# EAGLE design Hank2 (EAGLE 7.7.0)
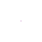
[diagram p0: schematic, sheet 1, part 1 of 2]
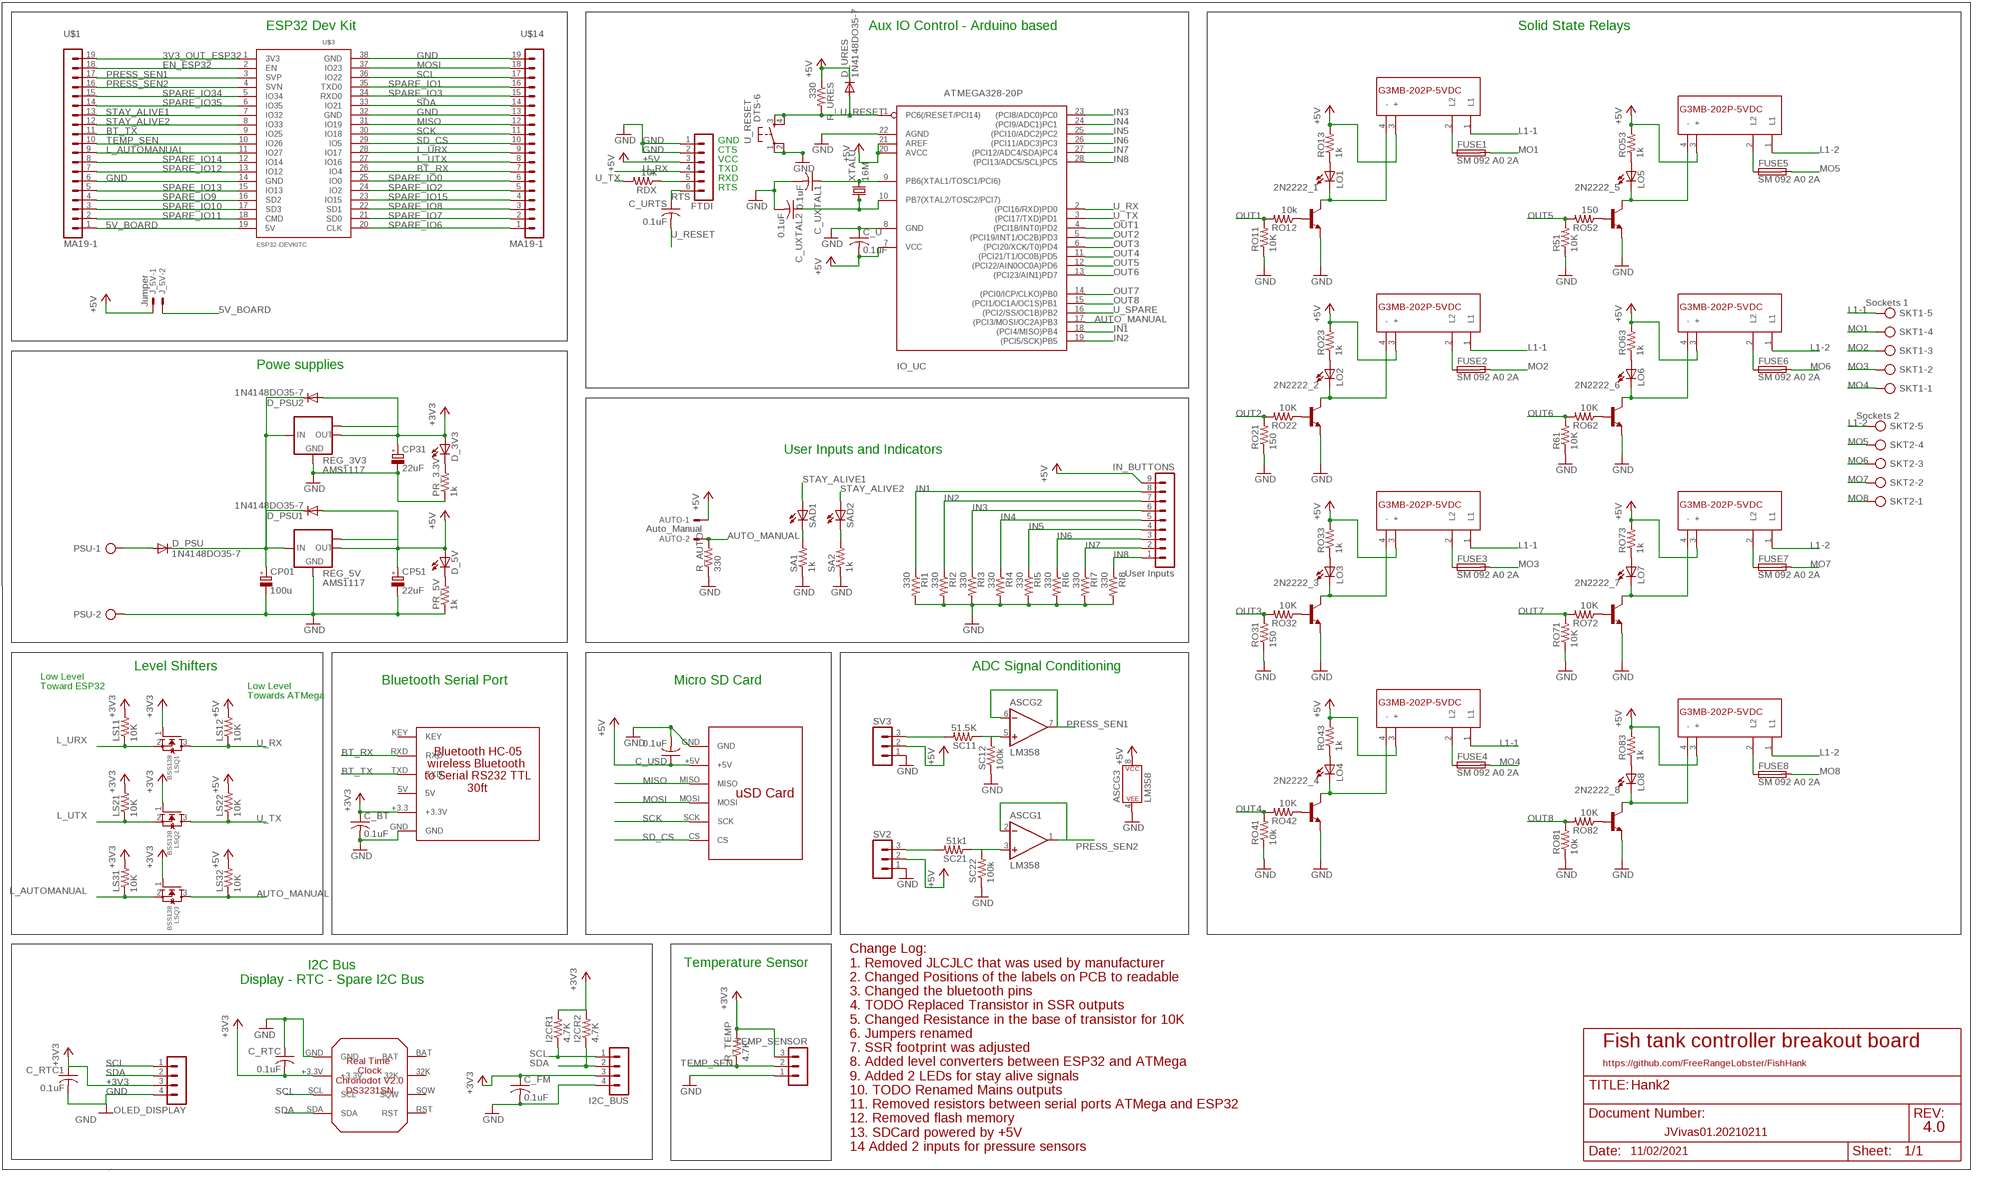
[diagram p1: schematic, sheet 1, part 2 of 2]

## Parts
2N2222_1  -NPN-TO92-EBC  [TO92-EBC]
2N2222_2  -NPN-TO92-EBC  [TO92-EBC]
2N2222_3  -NPN-TO92-EBC  [TO92-EBC]
2N2222_4  -NPN-TO92-EBC  [TO92-EBC]
2N2222_5  -NPN-TO92-EBC  [TO92-EBC]
2N2222_6  -NPN-TO92-EBC  [TO92-EBC]
2N2222_7  -NPN-TO92-EBC  [TO92-EBC]
2N2222_8  -NPN-TO92-EBC  [TO92-EBC]
ASC  LM358  [DIP08]
AUTO  Auto_Manual  22-23-2021  [22-23-2021]
C_BT  0.1uF  C-US025-024X044  [C025-024X044]
C_FM  0.1uF  C-US025-024X044  [C025-024X044]
C_RTC  0.1uF  C-US025-024X044  [C025-024X044]
C_RTC1  0.1uF  C-US025-024X044  [C025-024X044]
C_U  0.1uF  C-US025-024X044  [C025-024X044]
C_URTS  0.1uF  C-US025-024X044  [C025-024X044]
C_USD  0.1uF  C-US025-024X044  [C025-024X044]
C_UXTAL1  0.1uF  C-US025-024X044  [C025-024X044]
C_UXTAL2  0.1uF  C-US025-024X044  [C025-024X044]
CP01  100u  CPOL-EUE2.5-6  [E2,5-6]
CP31  22uF  CPOL-EUE2.5-6  [E2,5-6]
CP51  22uF  CPOL-EUE2.5-6  [E2,5-6]
D_3V3  LED3MM  [LED3MM]
D_5V  LED3MM  [LED3MM]
D_PSU  1N4148DO35-7  [DO35-7]
D_PSU1  1N4148DO35-7  [DO35-7]
D_PSU2  1N4148DO35-7  [DO35-7]
D_URES  1N4148DO35-7  [DO35-7]
FTDI  MA06-1  [MA06-1]
FUSE1  SM 092 A0 2A  FUSEPICOFUSE  [PICOFUSE]
FUSE2  SM 092 A0 2A  FUSEPICOFUSE  [PICOFUSE]
FUSE3  SM 092 A0 2A  FUSEPICOFUSE  [PICOFUSE]
FUSE4  SM 092 A0 2A  FUSEPICOFUSE  [PICOFUSE]
FUSE5  SM 092 A0 2A  FUSEPICOFUSE  [PICOFUSE]
FUSE6  SM 092 A0 2A  FUSEPICOFUSE  [PICOFUSE]
FUSE7  SM 092 A0 2A  FUSEPICOFUSE  [PICOFUSE]
FUSE8  SM 092 A0 2A  FUSEPICOFUSE  [PICOFUSE]
I2C_BUS  MA04-1  [MA04-1]
I2CR1  4.7K  R-US_0207/10  [0207/10]
I2CR2  4.7K  R-US_0207/10  [0207/10]
IN_BUTTONS  User Inputs  MA09-1  [MA09-1]
IO_UC  ATMEGA328-20P  [DIL28-3]
J_5V  Jumper  22-23-2021  [22-23-2021]
LO1  LED3MM  [LED3MM]
LO2  LED3MM  [LED3MM]
LO3  LED3MM  [LED3MM]
LO4  LED3MM  [LED3MM]
LO5  LED3MM  [LED3MM]
LO6  LED3MM  [LED3MM]
LO7  LED3MM  [LED3MM]
LO8  LED3MM  [LED3MM]
LS11  10K  R-US_0207/10  [0207/10]
LS12  10K  R-US_0207/10  [0207/10]
LS21  10K  R-US_0207/10  [0207/10]
LS22  10K  R-US_0207/10  [0207/10]
LS31  10K  R-US_0207/10  [0207/10]
LS32  10K  R-US_0207/10  [0207/10]
LSQ1  BSS138  MOSFET-NREFLOW  [SOT23]
LSQ2  BSS138  MOSFET-NREFLOW  [SOT23]
LSQ3  BSS138  MOSFET-NREFLOW  [SOT23]
OLED_DISPLAY  MA04-1  [MA04-1]
PR_3.3V  1k  R-US_0207/10  [0207/10]
PR_5V  1k  R-US_0207/10  [0207/10]
PSU  AK500/2  [AK500/2]
R51  10K  R-US_0207/10  [0207/10]
R61  10K  R-US_0207/10  [0207/10]
R_AUTO  330  R-US_0207/10  [0207/10]
R_TEMP  4.7K  R-US_0207/10  [0207/10]
R_URES  330  R-US_0207/10  [0207/10]
RDX  10k  R-US_0207/10  [0207/10]
REG_3V3  AMS1117  [SOT223]
REG_5V  AMS1117  [SOT223]
RI1  330  R-US_0207/10  [0207/10]
RI2  330  R-US_0207/10  [0207/10]
RI3  330  R-US_0207/10  [0207/10]
RI4  330  R-US_0207/10  [0207/10]
RI5  330  R-US_0207/10  [0207/10]
RI6  330  R-US_0207/10  [0207/10]
RI7  330  R-US_0207/10  [0207/10]
RI8  330  R-US_0207/10  [0207/10]
RO11  10K  R-US_0207/10  [0207/10]
RO12  10k  R-US_0207/10  [0207/10]
RO13  1k  R-US_0207/10  [0207/10]
RO21  150  R-US_0207/10  [0207/10]
RO22  10K  R-US_0207/10  [0207/10]
RO23  1k  R-US_0207/10  [0207/10]
RO31  150  R-US_0207/10  [0207/10]
RO32  10K  R-US_0207/10  [0207/10]
RO33  1k  R-US_0207/10  [0207/10]
RO41  10k  R-US_0207/10  [0207/10]
RO42  10K  R-US_0207/10  [0207/10]
RO43  1k  R-US_0207/10  [0207/10]
RO52  150  R-US_0207/10  [0207/10]
RO53  1k  R-US_0207/10  [0207/10]
RO62  10K  R-US_0207/10  [0207/10]
RO63  1k  R-US_0207/10  [0207/10]
RO71  10K  R-US_0207/10  [0207/10]
RO72  10K  R-US_0207/10  [0207/10]
RO73  1k  R-US_0207/10  [0207/10]
RO81  10k  R-US_0207/10  [0207/10]
RO82  10K  R-US_0207/10  [0207/10]
RO83  1k  R-US_0207/10  [0207/10]
SA1  1k  R-US_0207/10  [0207/10]
SA2  1k  R-US_0207/10  [0207/10]
SAD1  LED3MM  [LED3MM]
SAD2  LED3MM  [LED3MM]
SC11  51.5K  R-US_0207/10  [0207/10]
SC12  100k  R-US_0207/10  [0207/10]
SC21  51k1  R-US_0207/10  [0207/10]
SC22  100k  R-US_0207/10  [0207/10]
SKT1  Sockets 1  AK500/5  [AK500/5]
SKT2  Sockets 2  AK500/5  [AK500/5]
SV2  MA03-1  [MA03-1]
SV3  MA03-1  [MA03-1]
TEMP_SENSOR  MA03-1  [MA03-1]
U$1  MA19-1  [MA19-1]
U$2  BLUETOOTH  [BLUETOOTH_FOOTPRINT]
U$3  ESP32DEVKITC  [ESP32-DEVKITC]
U$4  SSR  [SSR_FOOTPRINT]
U$5  SSR  [SSR_FOOTPRINT]
U$6  RTC  [RTC_FOOTPRINT]
U$8  SSR  [SSR_FOOTPRINT]
U$9  SSR  [SSR_FOOTPRINT]
U$10  SSR  [SSR_FOOTPRINT]
U$11  SSR  [SSR_FOOTPRINT]
U$12  SSR  [SSR_FOOTPRINT]
U$13  SSR  [SSR_FOOTPRINT]
U$14  MA19-1  [MA19-1]
U$15  SD_CARD_READER  [SD_CARD_READER_FOOTPRINT]
U_RESET  DTS-6  [DTS-6]
XTALU  16M  CRYSTALHC49S  [HC49/S]

## Nets
2N2222_6: 2N2222_6.C LO6.K(C) U$11.4(-)
3V3_OUT_ESP32: U$1.19 U$3.1(3V3)
5V_BOARD: J_5V.2 U$1.1 U$3.19(5V)
+3V3: C_BT.1 C_FM.1 C_RTC1.1 C_RTC.2 CP31.+ D_3V3.A D_PSU2.A I2C_BUS.3 I2CR1.2 I2CR2.2 LS11.2 LS21.2 LS31.2 LSQ1.1(G) LSQ2.1(G) LSQ3.1(G) OLED_DISPLAY.3 R_TEMP.2 REG_3V3.2(OUT) REG_3V3.TAB(OUT1) TEMP_SENSOR.3 U$2.+3.3(+3.3V) U$6.+3.3V
+5V: ASC.8(P$V+) AUTO.1 C_U.2 C_USD.1 CP51.+ D_5V.A D_PSU1.A D_URES.C FTDI.3 IN_BUTTONS.9 IO_UC.7(VCC) IO_UC.20(AVCC) IO_UC.21(AREF) J_5V.1 LS12.2 LS22.2 LS32.2 R_URES.1 REG_5V.2(OUT) REG_5V.TAB(OUT1) RO13.2 RO23.2 RO33.2 RO43.2 RO53.2 RO63.2 RO73.2 RO83.2 SV2.2 SV3.2 U$4.3(+) U$5.3(+) U$8.3(+) U$9.3(+) U$10.3(+) U$11.3(+) U$12.3(+) U$13.3(+) U$15.+5V
AUTO_MANUAL: AUTO.2 IO_UC.17((PCI3/MOSI/OC2A)PB3) LS32.1 LSQ3.3(D) R_AUTO.2
BT_RX: U$2.RXD U$3.26(IO4) U$14.7
BT_TX: U$1.11 U$2.TXD U$3.9(IO25)
CP12: CP01.+ D_PSU1.C D_PSU2.C D_PSU.C REG_3V3.3(IN) REG_5V.3(IN)
EN_ESP32: U$1.18 U$3.2(EN)
GND [vcc]: 2N2222_1.E 2N2222_2.E 2N2222_3.E 2N2222_4.E 2N2222_5.E 2N2222_6.E 2N2222_7.E 2N2222_8.E ASC.4(P$V-) C_BT.2 C_FM.2 C_RTC1.2 C_RTC.1 C_U.1 C_USD.2 C_UXTAL1.2 C_UXTAL2.2 CP01.- CP31.- CP51.- FTDI.1 FTDI.2 I2C_BUS.4 IO_UC.8(GND) IO_UC.22(AGND) OLED_DISPLAY.4 PR_3.3V.1 PR_5V.1 PSU.2 R51.1 R61.1 R_AUTO.1 REG_3V3.1(GND) REG_5V.1(GND) RI1.2 RI2.2 RI3.2 RI4.2 RI5.2 RI6.2 RI7.2 RI8.2 RO11.1 RO21.1 RO31.1 RO41.1 RO71.1 RO81.1 SA1.1 SA2.1 SC12.1 SC22.1 SV2.1 SV3.1 TEMP_SENSOR.1 U$1.6 U$2.GND U$3.14(GND) U$3.32(GND) U$3.38(GND) U$6.GND U$14.13 U$14.19 U$15.GND U_RESET.1 U_RESET.2
IN1: IN_BUTTONS.8 IO_UC.18((PCI4/MISO)PB4) RI1.1
IN2: IN_BUTTONS.7 IO_UC.19((PCI5/SCK)PB5) RI2.1
IN3: IN_BUTTONS.6 IO_UC.23((PCI8/ADC0)PC0) RI3.1
IN4: IN_BUTTONS.5 IO_UC.24((PCI9/ADC1)PC1) RI4.1
IN5: IN_BUTTONS.4 IO_UC.25((PCI10/ADC2)PC2) RI5.1
IN6: IN_BUTTONS.3 IO_UC.26((PCI11/ADC3)PC3) RI6.1
IN7: IN_BUTTONS.2 IO_UC.27((PCI12/ADC4/SDA)PC4) RI7.1
IN8: IN_BUTTONS.1 IO_UC.28((PCI13/ADC5/SCL)PC5) RI8.1
L1-1: SKT1.5 U$4.1(L1) U$5.1(L1) U$8.1(L1) U$10.1(L1)
L1-2: SKT2.5 U$9.1(L1) U$11.1(L1) U$12.1(L1) U$13.1(L1)
L_AUTOMANUAL: LS31.1 LSQ3.2(S) U$1.9 U$3.11(IO27)
L_O1: 2N2222_2.C LO2.K(C) U$8.4(-)
L_O3: 2N2222_3.C LO3.K(C) U$5.4(-)
L_URX: LS11.1 LSQ1.2(S) U$3.28(IO17) U$14.9
L_UTX: LS21.1 LSQ2.2(S) U$3.27(IO16) U$14.8
LED2: SA2.2 SAD2.K(C)
MISO: U$3.31(IO19) U$14.12 U$15.MISO
MO1: FUSE1.2 SKT1.4
MO2: FUSE2.2 SKT1.3
MO3: FUSE3.2 SKT1.2
MO4: FUSE4.2 SKT1.1
MO5: FUSE5.2 SKT2.4
MO6: FUSE6.2 SKT2.3
MO7: FUSE7.2 SKT2.2
MO8: FUSE8.2 SKT2.1
MOSI: U$3.37(IO23) U$14.18 U$15.MOSI
N$2: 2N2222_1.B RO12.1
N$3: FUSE1.1 U$4.2(L2)
N$4: D_5V.K(C) PR_5V.2
N$5: D_3V3.K(C) PR_3.3V.2
N$6: SA1.2 SAD1.K(C)
N$7: D_PSU.A PSU.1
N$8: 2N2222_5.B RO52.1
N$9: 2N2222_6.B RO62.1
N$10: FUSE8.1 U$13.2(L2)
N$11: LO5.A RO53.1
N$12: 2N2222_5.C LO5.K(C) U$9.4(-)
N$13: FUSE7.1 U$12.2(L2)
N$14: FUSE2.1 U$8.2(L2)
N$15: FUSE3.1 U$5.2(L2)
N$16: LO6.A RO63.1
N$18: 2N2222_2.B RO22.1
N$19: FUSE6.1 U$11.2(L2)
N$20: LO7.A RO73.1
N$21: 2N2222_7.C LO7.K(C) U$12.4(-)
N$22: 2N2222_7.B RO72.1
N$23: 2N2222_3.B RO32.1
N$24: FUSE4.1 U$10.2(L2)
N$25: LO8.A RO83.1
N$26: 2N2222_8.C LO8.K(C) U$13.4(-)
N$27: 2N2222_4.B RO42.1
N$28: FUSE5.1 U$9.2(L2)
N$29: LO1.A RO13.1
N$30: 2N2222_1.C LO1.K(C) U$4.4(-)
N$31: 2N2222_8.B RO82.1
N$32: C_UXTAL1.1 IO_UC.9(PB6(XTAL1/TOSC1/PCI6)) XTALU.2
N$33: LO2.A RO23.1
N$35: C_UXTAL2.1 IO_UC.10(PB7(XTAL2/TOSC2/PCI7)) XTALU.1
N$37: LO3.A RO33.1
N$38: SC21.2 SV2.3
N$41: LO4.A RO43.1
N$42: 2N2222_4.C LO4.K(C) U$10.4(-)
N$43: ASC.5(+IN) SC11.1 SC12.2
N$44: ASC.3(+IN) SC21.1 SC22.2
N$47: SC11.2 SV3.3
OUT1: IO_UC.4((PCI18/INT0)PD2) RO11.2 RO12.2
OUT2: IO_UC.5((PCI19/INT1/OC2B)PD3) RO21.2 RO22.2
OUT3: IO_UC.6((PCI20/XCK/T0)PD4) RO31.2 RO32.2
OUT4: IO_UC.11((PCI21/T1/OC0B)PD5) RO41.2 RO42.2
OUT5: IO_UC.12((PCI22/AIN0OC0A)PD6) R51.2 RO52.2
OUT6: IO_UC.13((PCI23/AIN1)PD7) R61.2 RO62.2
OUT7: IO_UC.14((PCI0/ICP/CLKO)PB0) RO71.2 RO72.2
OUT8: IO_UC.15((PCI1/OC1A/OC1S)PB1) RO81.2 RO82.2
PRESS_SEN1: ASC.6(-IN) ASC.7(OUT) U$1.17 U$3.3(SVP)
PRESS_SEN2: ASC.1(OUT) ASC.2(-IN) U$1.16 U$3.4(SVN)
RTS: C_URTS.1 FTDI.6
SCK: U$3.30(IO18) U$14.11 U$15.SCK
SCL: I2C_BUS.1 I2CR1.1 OLED_DISPLAY.1 U$3.36(IO22) U$6.SCL U$14.17
SD_CS: U$3.29(IO5) U$14.10 U$15.CS
SDA: I2C_BUS.2 I2CR2.1 OLED_DISPLAY.2 U$3.33(IO21) U$6.SDA U$14.14
SPARE_IO0: U$3.25(IO0) U$14.6
SPARE_IO1: U$3.35(TXD0) U$14.16
SPARE_IO2: U$3.24(IO2) U$14.5
SPARE_IO3: U$3.34(RXD0) U$14.15
SPARE_IO6: U$3.20(CLK) U$14.1
SPARE_IO7: U$3.21(SD0) U$14.2
SPARE_IO8: U$3.22(SD1) U$14.3
SPARE_IO9: U$1.4 U$3.16(SD2)
SPARE_IO10: U$1.3 U$3.17(SD3)
SPARE_IO11: U$1.2 U$3.18(CMD)
SPARE_IO12: U$1.7 U$3.13(IO12)
SPARE_IO13: U$1.5 U$3.15(IO13)
SPARE_IO14: U$1.8 U$3.12(IO14)
SPARE_IO15: U$3.23(IO15) U$14.4
SPARE_IO34: U$1.15 U$3.5(IO34)
SPARE_IO35: U$1.14 U$3.6(IO35)
STAY_ALIVE1: SAD1.A U$1.13 U$3.7(IO32)
STAY_ALIVE2: SAD2.A U$1.12 U$3.8(IO33)
TEMP_SEN: R_TEMP.1 TEMP_SENSOR.2 U$1.10 U$3.10(IO26)
U_RESET: C_URTS.2 D_URES.A IO_UC.1(PC6(/RESET/PCI14)) R_URES.2 U_RESET.3 U_RESET.4
U_RX: FTDI.4 IO_UC.2((PCI16/RXD)PD0) LS12.1 LSQ1.3(D)
U_SPARE: IO_UC.16((PCI2/SS/OC1B)PB2)
U_TX: IO_UC.3((PCI17/TXD)PD1) LS22.1 LSQ2.3(D) RDX.2
UTX: FTDI.5 RDX.1
Unconnected: U$2.5V U$2.KEY U$6.32K U$6.BAT U$6.RST U$6.SQW

## Notes on the sheet
- ESP32 Dev Kit | Aux IO Control - Arduino based | Solid State Relays
- GND
- CTS
- VCC
- TXD
- RXD
- RTS
- Powe supplies
- User Inputs and Indicators
- Level Shifters | ADC Signal Conditioning
- Bluetooth Serial Port | Micro SD Card
- Low Level
  Toward ESP32
- Low Level
  Towards ATMega
- Temperature Sensor
- I2C Bus
  Display - RTC - Spare I2C Bus
- Fish tank controller breakout board
- https://github.com/FreeRangeLobster/FishHank
- JVivas01.20210211 | 4.0
- Change Log:
  1. Removed JLCJLC that was used by manufacturer
  2. Changed Positions of the labels on PCB to readable
  3. Changed the bluetooth pins
  4. TODO Replaced Transistor in SSR outputs
  5. Changed Resistance in the base of transistor for 10K
  6. Jumpers renamed
  7. SSR footprint was adjusted
  8. Added level converters between ESP32 and ATMega
  9. Added 2 LEDs for stay alive signals
  10. TODO Renamed Mains outputs
  11. Removed resistors between serial ports ATMega and ESP32
  12. Removed flash memory
  13. SDCard powered by +5V
  14 Added 2 inputs for pressure sensors
- 11/02/2021

## Library data of the parts
2N2222_1-2N2222_8 = transistor:*-NPN-: NPN Transistror BF959 corrected 2008.03.06
ASC = SparkFun-IC-Amplifiers:LM358: LM358 Jellybean op-amp Datasheet <http://www.sparkfun.com/datasheets/Components/General/LM358.pdf> SparkFun Products Op-Amp (Thru-Hole) - LM358 <https://www.sparkfun.com/products/9456> (COM-09456); PROD_ID: IC-09172
AUTO J_5V = con-molex:22-23-2021: .100" (2.54mm) Center Header - 2 Pin; MF: MOLEX; MPN: 22-23-2021; OC_FARNELL: 1462926; OC_NEWARK: 25C3832
C_BT C_FM C_RTC C_RTC1 C_U C_URTS C_USD C_UXTAL1 C_UXTAL2 = rcl:C-US: CAPACITOR, American symbol
CP01 CP31 CP51 = rcl:CPOL-EU: POLARIZED CAPACITOR, European symbol
D_3V3 D_5V LO1-LO8 SAD1 SAD2 = led:LED: LED OSRAM: - CHIPLED LG R971, LG N971, LY N971, LG Q971, LY Q971, LO R971, LY R971 LH N974, LH R974 LS Q976, LO Q976, LY Q976 LO Q996 - Hyper CHIPLED LW Q18S LB Q993, LB Q99A, LB R99A - SideLED LS A670, LO A670, LY A670, LG A670, LP A670 LB A673, LV A673, LT A673, LW A673 LH A674 LY A675 LS A676, LA A676, LO A676, LY A676, LW A676 LS A679, LY A679, LG A679 - Hyper Micro SIDELED® LS Y876, LA Y876, LO Y876, LY Y876 LT Y87S - SmartLED LW L88C, LW L88S LB L89C, LB L89S, LG L890 LS L89K, LO L89K, LY L89K LS L896, LA L896, LO L896, LY L896 - TOPLED LS T670, LO T670, LY T670, LG T670, LP T670 LSG T670, LSP T670, LSY T670, LOP T670, LYG T670 LG T671, LOG T671, LSG T671 LB T673, LV T673, LT T673, LW T673 LH T674 LS T676, LA T676, LO T676, LY T676, LB T676, LH T676, LSB T676, LW T676 LB T67C, LV T67C, LT T67C, LS T67K, LO T67K, LY T67K, LW E67C LS E67B, LA E67B, LO E67B, LY E67B, LB E67C, LV E67C, LT E67C LW T67C LS T679, LY T679, LG T679 LS T770, LO T770, LY T770, LG T770, LP T770 LB T773, LV T773, LT T773, LW T773 LH T774 LS E675, LA E675, LY E675, LS T675 LS T776, LA T776, LO T776, LY T776, LB T776 LHGB T686 LT T68C, LB T68C - Hyper Mini TOPLED® LB M676 - Mini TOPLED Santana® LG M470 LS M47K, LO M47K, LY M47K Source: http://www.osram.convergy.de LUXEON: - LUMILED® LXK2-PW12-R00, LXK2-PW12-S00, LXK2-PW14-U00, LXK2-PW14-V00 LXK2-PM12-R00, LXK2-PM12-S00, LXK2-PM14-U00 LXK2-PE12-Q00, LXK2-PE12-R00, LXK2-PE12-S00, LXK2-PE14-T00, LXK2-PE14-U00 LXK2-PB12-K00, LXK2-PB12-L00, LXK2-PB12-M00, LXK2-PB14-N00, LXK2-PB14-P00, LXK2-PB14-Q00 LXK2-PR12-L00, LXK2-PR12-M00, LXK2-PR14-Q00, LXK2-PR14-R00 LXK2-PD12-Q00, LXK2-PD12-R00, LXK2-PD12-S00 LXK2-PH12-R00, LXK2-PH12-S00 LXK2-PL12-P00, LXK2-PL12-Q00, LXK2-PL12-R00 Source: www.luxeon.com KINGBRIGHT: KA-3528ASYC Source: www.kingbright.com
D_PSU D_PSU1 D_PSU2 D_URES = diode:1N4148: DIODE high speed (Philips)
FTDI = con-lstb:MA06-1: PIN HEADER; OC_FARNELL: unknown; OC_NEWARK: unknown
FUSE1-FUSE8 = fuse:FUSE: Fuse; OC_FARNELL: unknown; OC_NEWARK: unknown
I2C_BUS OLED_DISPLAY = con-lstb:MA04-1: PIN HEADER; OC_FARNELL: unknown; OC_NEWARK: unknown
I2CR1 I2CR2 LS11 LS12 LS21 LS22 LS31 LS32 PR_3.3V PR_5V R51 R61 R_AUTO R_TEMP R_URES RDX RI1-RI8 RO11-RO13 RO21-RO23 RO31-RO33 RO41-RO43 RO52 RO53 RO62 RO63 RO71-RO73 RO81-RO83 SA1 SA2 SC11 SC12 SC21 SC22 = rcl:R-US_: RESISTOR, American symbol
IN_BUTTONS = con-lstb:MA09-1: PIN HEADER; OC_FARNELL: unknown; OC_NEWARK: unknown
IO_UC = atmega328:ATMEGA328*P: MICROCONTROLLER 32 kBytes FLASH 2 kBytes SRAM 1 kBytes EEPROM USART 8-channel 10 bit ADC
LSQ1-LSQ3 = adafruit:MOSFET-N: N-Channel Mosfet 2N7002E - 60V 260mA SOT23 [Digikey: 2N7002ET1GOSTR-ND] - REEL BSH103 - 30V 850mA SOT23 [Digikey: 568-5013-1-ND]
PSU = con-ptr500:AK500/2: CONNECTOR; OC_FARNELL: unknown; OC_NEWARK: unknown
REG_3V3 REG_5V = AMS117:AMS1117
SKT1 SKT2 = con-ptr500:AK500/5: CONNECTOR; OC_FARNELL: unknown; OC_NEWARK: unknown
SV2 SV3 TEMP_SENSOR = con-lstb:MA03-1: PIN HEADER; OC_FARNELL: unknown; OC_NEWARK: unknown
U$1 U$14 = con-lstb:MA19-1
U$2 = HankLibrariesV2:BLUETOOTH
U$3 = ESP32-DEVKITC:ESP32DEVKITC
U$4 U$5 U$8-U$13 = HankLibrariesV2:SSR
U$6 = HankLibraries:RTC: Real Time Clock PCB Using DS3231SN. Developed by JVivas
U$15 = HankLibrariesV2:SD_CARD_READER
U_RESET = switch-tact:DTS-6
XTALU = crystal:CRYSTAL: CRYSTAL; OC_FARNELL: 1667008; OC_NEWARK: unknown

## Net classes
1 vcc: width 0.508 mm

## Board
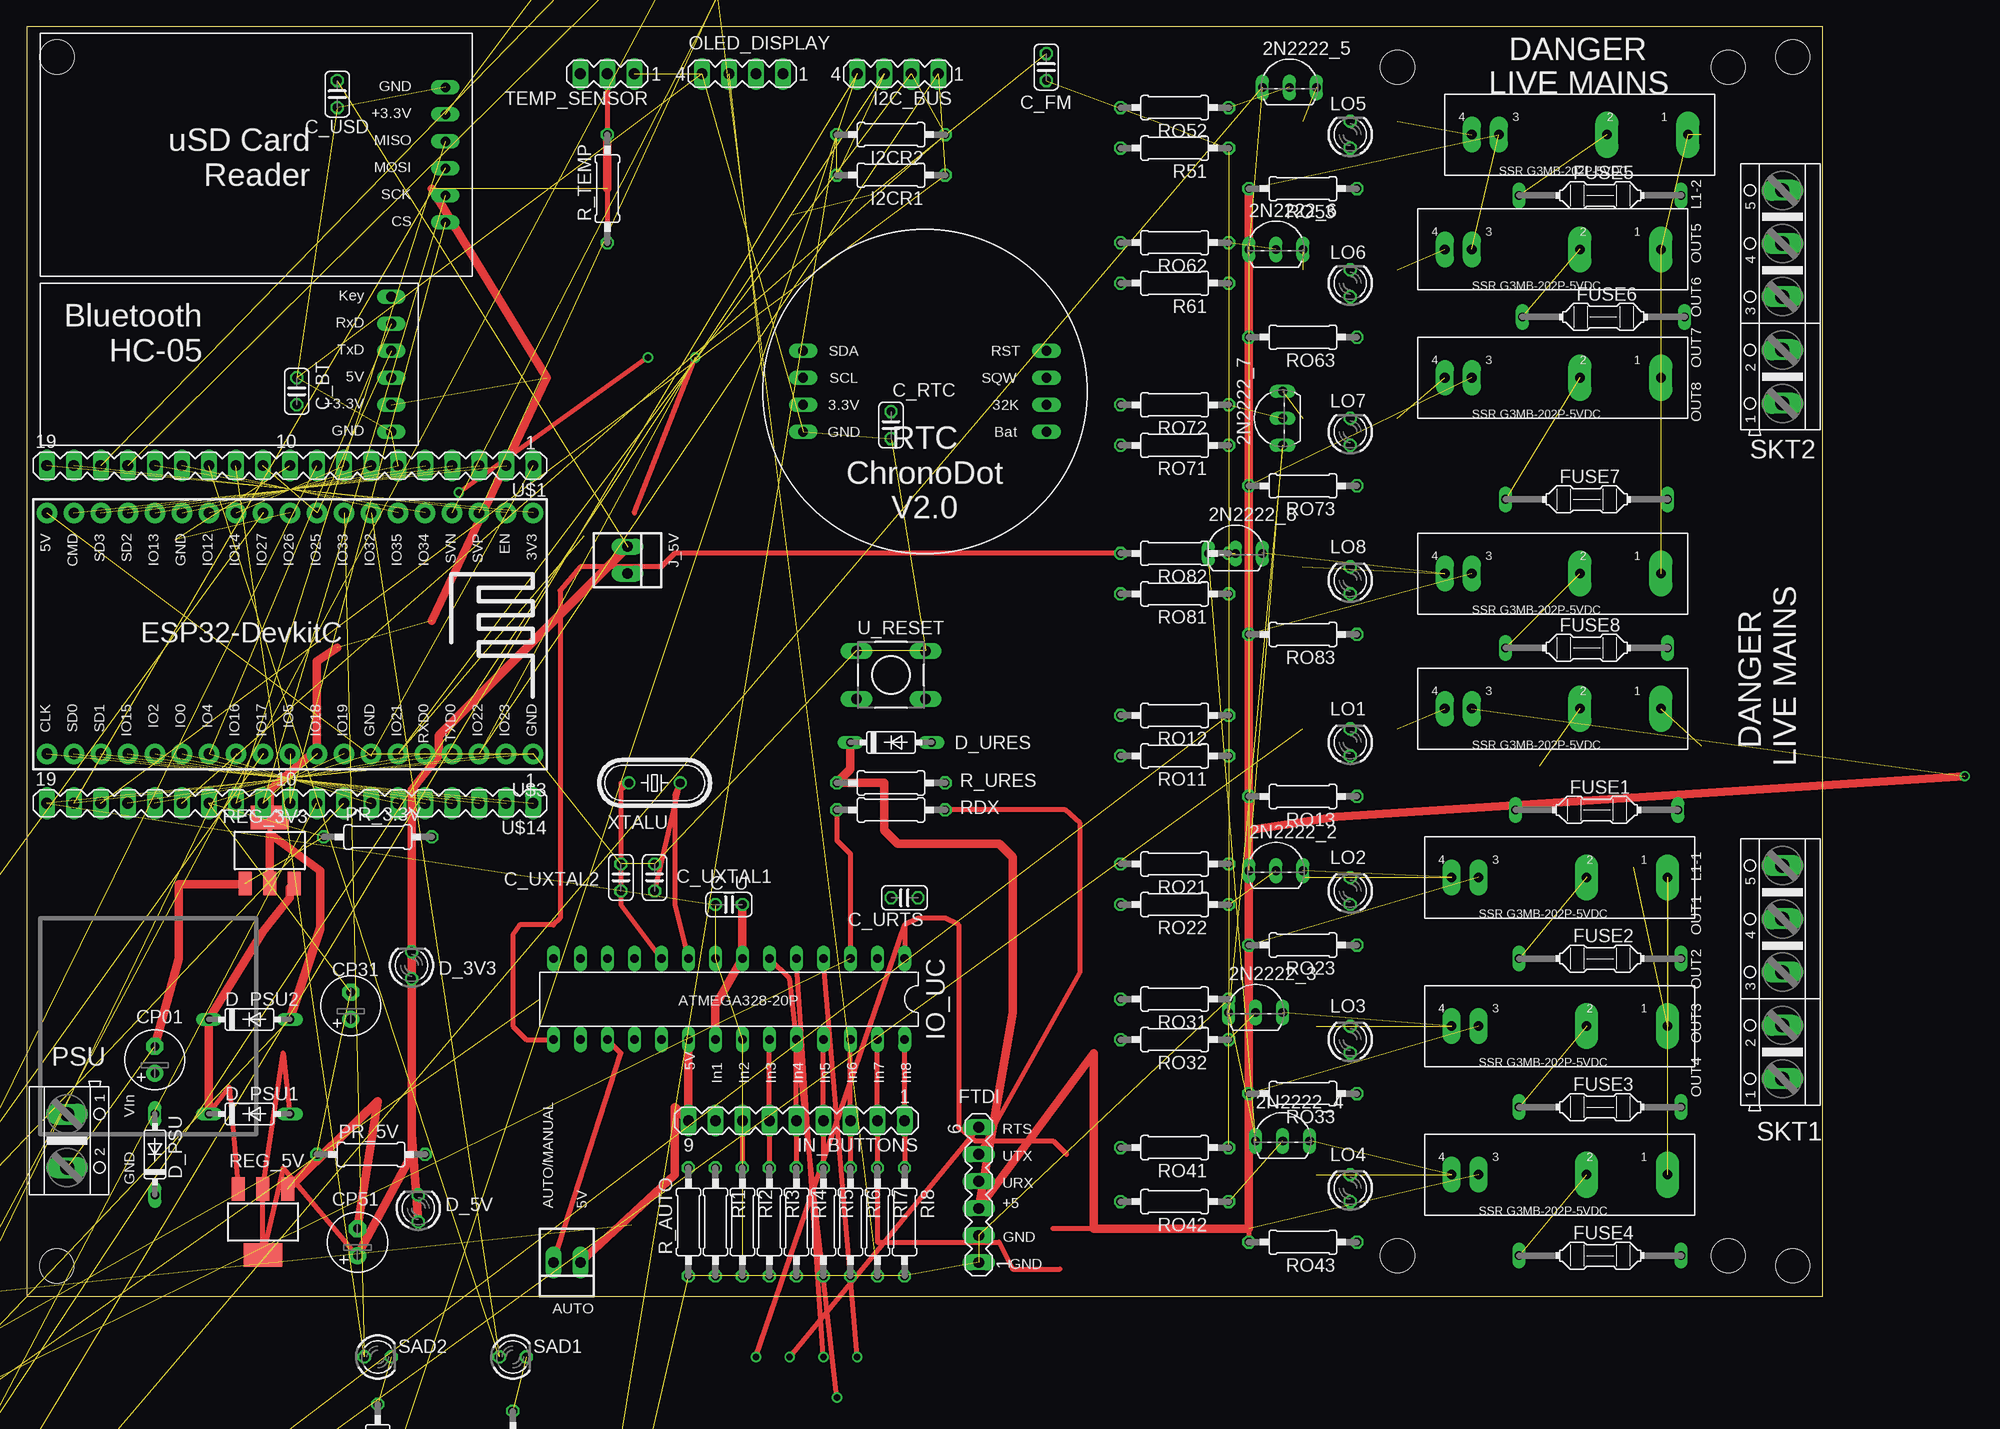
[diagram p2: board, top side]
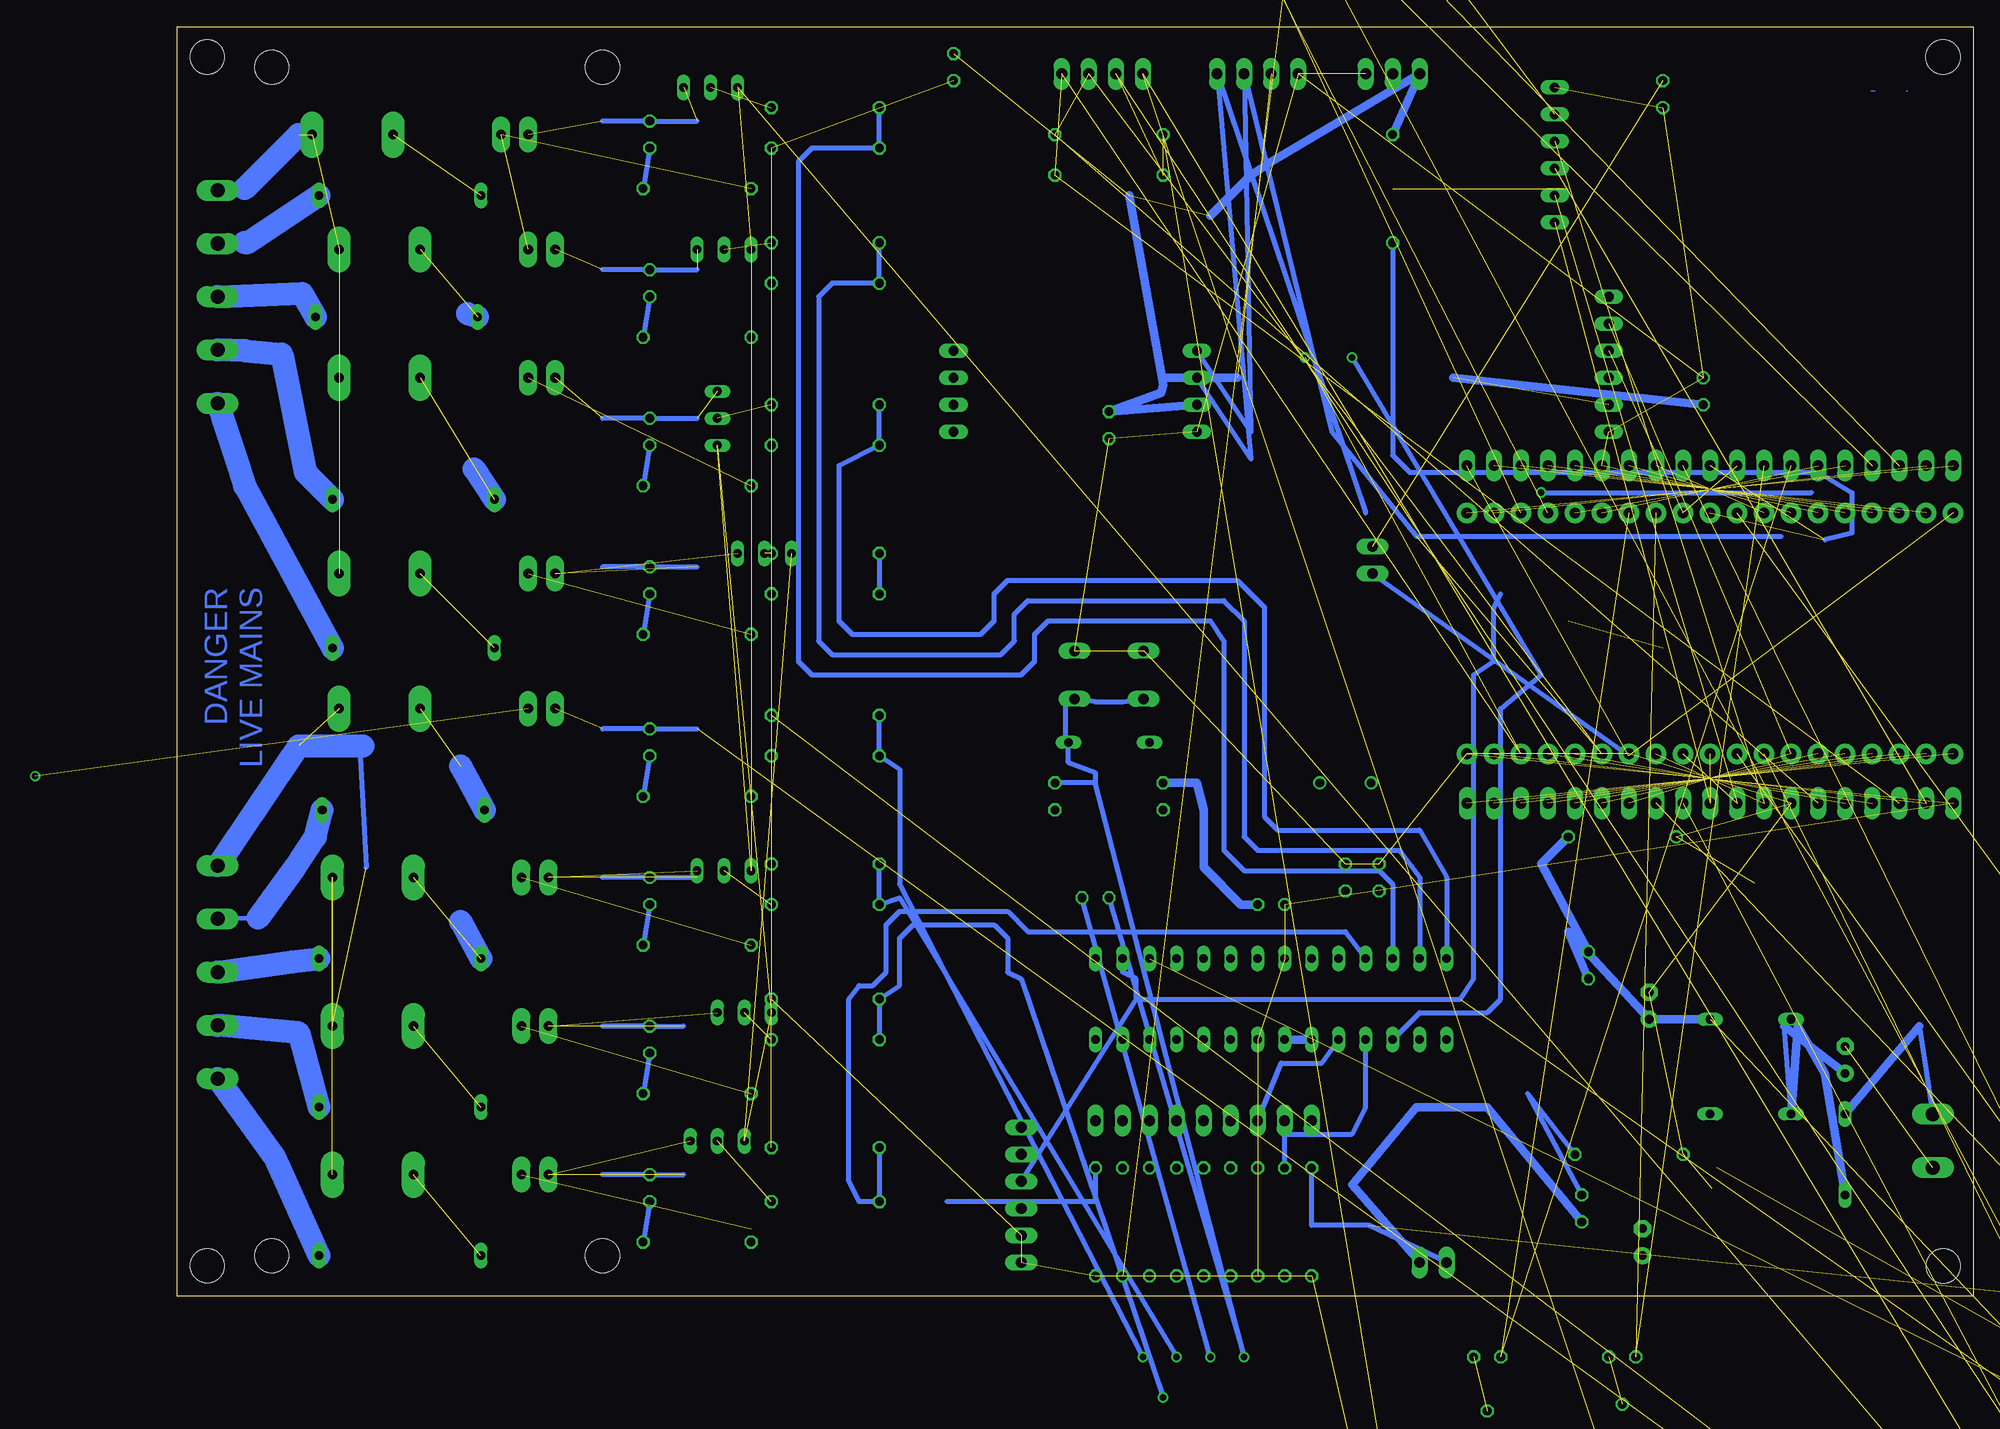
[diagram p3: board, bottom side, seen from below]

Size 168.91 x 119.38 mm. Coordinates in mm from the lower left corner, seen from the top.
Outline: 0,0 168.89,0 168.91,119.38 0,119.38 0,0
Copper layers (1*16): Top 0.0356mm / dielectric 1.5011mm / Bottom 0.0356mm
Design rules "default *": minimum track width 18mil, minimum drill 24mil, track to track 8mil, track to pad 8mil, pad to pad 8mil, via to via 8mil, smd to smd 0mil, copper to edge 40mil, drill to drill 8mil, minimum pad ring 7mil, minimum via ring 7mil, stop-mask expansion 4mil, vias tented up to drill 0mil, thermal gap 10mil
Holes 3.2 mm at 2.83,2.84 2.86,116.52 166.05,116.52 166.05,2.86 160.02,115.57 128.91,115.57 160.02,3.81 128.91,3.81

### Footprints (pad centres in the part's own frame; a part is rotated, then mirrored left to right if it is on the bottom)
TO92-EBC = drill 0.813 long: B 0,-1.27; C 2.54,-1.27; E -2.54,-1.27
DIP08 = drill 0.813 pad 1.626: 1 -3.81,-3.81; 2 -1.27,-3.81; 3 1.27,-3.81; 4 3.81,-3.81; 5 3.81,3.81; 6 1.27,3.81; 7 -1.27,3.81; 8 -3.81,3.81
22-23-2021 = drill 1 long: 1 -1.27,0; 2 1.27,0
C025-024X044 = drill 0.813 octagon: 1 -1.27,0; 2 1.27,0
E2,5-6 = drill 0.813 pad 1.6: + -1.27,0 | drill 0.813 pad 1.6 octagon: - 1.27,0
LED3MM = drill 0.813 octagon: A -1.27,0; K 1.27,0
DO35-7 = drill 0.813 long: A 3.81,0; C -3.81,0
MA06-1 = drill 1.016 long: 1 -6.35,0; 2 -3.81,0; 3 -1.27,0; 4 1.27,0; 5 3.81,0; 6 6.35,0
PICOFUSE = drill 0.813 long: 1 -7.62,0; 2 7.62,0
MA04-1 = drill 1.016 long: 1 -3.81,0; 2 -1.27,0; 3 1.27,0; 4 3.81,0
0207/10 = drill 0.813 octagon: 1 -5.08,0; 2 5.08,0
MA09-1 = drill 1.016 long: 1 -10.16,0; 2 -7.62,0; 3 -5.08,0; 4 -2.54,0; 5 0,0; 6 2.54,0; 7 5.08,0; 8 7.62,0; 9 10.16,0
DIL28-3 = drill 0.813 long: 1 -16.51,-3.81; 2 -13.97,-3.81; 3 -11.43,-3.81; 4 -8.89,-3.81; 5 -6.35,-3.81; 6 -3.81,-3.81; 7 -1.27,-3.81; 8 1.27,-3.81; 9 3.81,-3.81; 10 6.35,-3.81; 11 8.89,-3.81; 12 11.43,-3.81; 13 13.97,-3.81; 14 16.51,-3.81; 15 16.51,3.81; 16 13.97,3.81; 17 11.43,3.81; 18 8.89,3.81; 19 6.35,3.81; 20 3.81,3.81; 21 1.27,3.81; 22 -1.27,3.81; 23 -3.81,3.81; 24 -6.35,3.81; 25 -8.89,3.81; 26 -11.43,3.81; 27 -13.97,3.81; 28 -16.51,3.81
SOT23 = smd 1 x 1.4: 1 -0.95,-1.1; 2 0.95,-1.1; 3 0,1.1
AK500/2 = drill 1.321 long: 1 -2.515,0; 2 2.515,0
SOT223 = smd 1.219 x 2.235: 1 -2.311,-3.099; 2 0,-3.099; 3 2.311,-3.099 | smd 3.6 x 2.2: TAB 0,3.099
AK500/5 = drill 1.321 long: 1 -10.033,0; 2 -5.004,0; 3 0,0; 4 5.004,0; 5 10.008,0
MA03-1 = drill 1.016 long: 1 -2.54,0; 2 0,0; 3 2.54,0
MA19-1 = drill 1.016 long: 1 -24.13,0; 2 -21.59,0; 3 -19.05,0; 4 -16.51,0; 5 -13.97,0; 6 -11.43,0; 7 -8.89,0; 8 -6.35,0; 9 -3.81,0; 10 -1.27,0; 11 1.27,0; 12 3.81,0; 13 6.35,0; 14 8.89,0; 15 11.43,0; 16 13.97,0; 17 16.51,0; 18 19.05,0; 19 21.59,0
BLUETOOTH_FOOTPRINT = drill 0.9 long: 5V -15.24,1.27; +3.3 -15.24,3.81; GND -15.24,6.35; KEY -15.24,-6.35; RXD -15.24,-3.81; TXD -15.24,-1.27
ESP32-DEVKITC = drill 1 pad 1.93: 1 -22.87,-11.42; 2 -20.33,-11.42; 3 -17.79,-11.42; 4 -15.25,-11.42; 5 -12.71,-11.42; 6 -10.17,-11.42; 7 -7.63,-11.42; 8 -5.09,-11.42; 9 -2.55,-11.42; 10 -0.01,-11.42; 11 2.53,-11.42; 12 5.07,-11.42; 13 7.61,-11.42; 14 10.15,-11.42; 15 12.69,-11.42; 16 15.23,-11.42; 17 17.77,-11.42; 18 20.31,-11.42; 19 22.85,-11.42; 20 22.85,11.23; 21 20.31,11.23; 22 17.77,11.23; 23 15.23,11.23; 24 12.69,11.23; 25 10.15,11.23; 26 7.61,11.23; 27 5.07,11.23; 28 2.53,11.23; 29 -0.01,11.23; 30 -2.55,11.23; 31 -5.09,11.23; 32 -7.63,11.23; 33 -10.17,11.23; 34 -12.71,11.23; 35 -15.25,11.23; 36 -17.79,11.23; 37 -20.33,11.23; 38 -22.87,11.23
SSR_FOOTPRINT = drill 0.9 pad 2.184 long: 1 10.16,0; 2 2.54,0 | drill 0.9 pad 1.676 long: 3 -7.62,0; 4 -10.16,0
RTC_FOOTPRINT = drill 0.9 long: 32K -11.43,0; +3.3V 11.43,0; BAT -11.43,2.54; GND 11.43,2.54; RST -11.43,-5.08; SCL 11.43,-2.54; SDA 11.43,-5.08; SQW -11.43,-2.54
SD_CARD_READER_FOOTPRINT = drill 0.9 long: +5V -17.78,-3.81; CS -17.78,6.35; GND -17.78,-6.35; MISO -17.78,-1.27; MOSI -17.78,1.27; SCK -17.78,3.81
DTS-6 = drill 1 long: 1 -3.25,2.25; 2 3.25,2.25; 3 -3.25,-2.25; 4 3.25,-2.25
HC49/S = drill 0.813: 1 -2.413,0; 2 2.413,0

### Placement (x,y rotation side)
2N2222_1  -13.97,-40.64 0 top  (outside the outline)
2N2222_2  117.47,41.27 0 top
2N2222_3  115.57,27.94 0 top
2N2222_4  118.11,15.88 0 top
2N2222_5  118.75,114.94 0 top
2N2222_6  117.47,99.69 0 top
2N2222_7  116.84,82.55 90 top
2N2222_8  113.67,71.12 0 top
ASC  74.93,142.88 0 top  (outside the outline)
AUTO  50.8,3.17 180 top
C_BT  25.4,85.09 90 top
C_FM  95.89,115.57 270 top
C_RTC  81.28,81.92 90 top
C_RTC1  56.52,-17.14 0 top  (outside the outline)
C_U  66.04,36.83 0 top
C_URTS  82.55,37.47 180 top
C_USD  29.21,113.03 270 top
C_UXTAL1  59.05,39.37 90 top
C_UXTAL2  55.88,39.37 90 top
CP01  12.06,22.23 90 top
CP31  30.48,27.3 90 top
CP51  31.11,5.08 90 top
D_3V3  36.2,31.11 90 top
D_5V  36.83,8.26 90 top
D_PSU  12.06,13.34 90 top
D_PSU1  20.95,17.14 0 top
D_PSU2  20.95,26.04 0 top
D_URES  81.28,52.07 0 top
FTDI  89.53,9.53 90 top
FUSE1  147.64,45.72 0 top
FUSE2  147.96,31.75 0 top
FUSE3  147.96,17.78 0 top
FUSE4  147.96,3.81 0 top
FUSE5  147.96,103.5 0 top
FUSE6  148.27,92.08 0 top
FUSE7  146.69,74.93 0 top
FUSE8  146.69,60.96 0 top
I2C_BUS  81.92,114.94 180 top
I2CR1  81.28,105.41 180 top
I2CR2  81.28,109.22 180 top
IN_BUTTONS  72.39,16.51 180 top
IO_UC  66.04,27.94 180 top
J_5V  56.52,69.22 270 top
LO1  124.46,52.07 90 top
LO2  124.46,38.1 90 top
LO3  124.46,24.13 90 top
LO4  124.46,10.16 90 top
LO5  124.46,109.22 90 top
LO6  124.46,95.25 90 top
LO7  124.46,81.28 90 top
LO8  124.46,67.31 90 top
LS11  -26.04,-23.5 0 top  (outside the outline)
LS12  -26.04,-27.94 0 top  (outside the outline)
LS21  -26.04,-17.78 0 top  (outside the outline)
LS22  -26.04,-13.34 0 top  (outside the outline)
LS31  -25.4,1.27 0 top  (outside the outline)
LS32  -26.04,-2.54 0 top  (outside the outline)
LSQ1  -12.7,-26.67 0 top  (outside the outline)
LSQ2  -13.34,-13.97 0 top  (outside the outline)
LSQ3  -13.34,-1.27 0 top  (outside the outline)
OLED_DISPLAY  67.31,114.94 180 top
PR_3.3V  33.02,43.18 0 top
PR_5V  32.38,13.34 0 top
PSU  3.81,14.61 270 top
R51  107.95,107.95 180 top
R61  107.95,95.25 180 top
R_AUTO  62.23,6.99 90 top
R_TEMP  54.61,104.14 90 top
R_URES  81.28,48.26 0 top
RDX  81.28,45.72 180 top
REG_3V3  22.86,41.91 0 top
REG_5V  22.23,6.99 180 top
RI1  64.77,6.99 270 top
RI2  67.31,6.99 270 top
RI3  69.85,6.99 270 top
RI4  72.39,6.99 270 top
RI5  74.93,6.99 270 top
RI6  77.47,6.99 270 top
RI7  80.01,6.99 270 top
RI8  82.55,6.99 270 top
RO11  107.95,50.8 180 top
RO12  107.95,54.61 180 top
RO13  120.02,46.99 180 top
RO21  107.95,40.64 180 top
RO22  107.95,36.83 180 top
RO23  120.02,33.02 180 top
RO31  107.95,27.94 180 top
RO32  107.95,24.13 180 top
RO33  120.02,19.05 180 top
RO41  107.95,13.97 180 top
RO42  107.95,8.89 180 top
RO43  120.02,5.08 180 top
RO52  107.95,111.76 180 top
RO53  120.02,104.14 180 top
RO62  107.95,99.06 180 top
RO63  120.02,90.17 180 top
RO71  107.95,80.01 180 top
RO72  107.95,83.82 180 top
RO73  120.02,76.2 180 top
RO81  107.95,66.04 180 top
RO82  107.95,69.85 180 top
RO83  120.02,62.23 180 top
SA1  45.72,-15.88 90 top  (outside the outline)
SA2  33.02,-15.24 90 top  (outside the outline)
SAD1  45.72,-5.71 0 top  (outside the outline)
SAD2  33.02,-5.71 0 top  (outside the outline)
SC11  90.81,132.72 0 top  (outside the outline)
SC12  90.81,128.91 180 top  (outside the outline)
SC21  76.2,128.27 180 top  (outside the outline)
SC22  76.2,132.08 0 top  (outside the outline)
SKT1  165.1,30.48 90 top
SKT2  165.1,93.98 90 top
SV2  63.5,130.18 90 top  (outside the outline)
SV3  62.23,141.6 270 top  (outside the outline)
TEMP_SENSOR  54.61,114.94 180 top
U$1  23.5,78.11 180 top
U$2  19.05,87.63 180 top
U$3  24.77,62.23 180 top
U$4  143.51,55.24 0 top
U$5  144.15,25.4 0 top
U$6  84.45,83.82 180 top
U$8  144.15,39.37 0 top
U$9  146.05,109.22 0 top
U$10  144.15,11.43 0 top
U$11  143.51,98.42 0 top
U$12  143.51,86.36 0 top
U$13  143.51,67.94 0 top
U$14  23.5,46.35 180 top
U$15  21.59,107.31 180 top
U_RESET  81.28,58.42 0 top
XTALU  59.05,48.26 0 top

### Tracks (layer width: path | path; a pad name or v marks a point on that pad's centre or on a via)
2N2222_6  (2 unrouted)
  Bottom 0.457: 120.02,96.52 LO6.K 128.91,96.52
3V3_OUT_ESP32  (1 unrouted)
5V_BOARD  (2 unrouted)
  Bottom 0.457: 32.38,50.8 J_5V.2
+3V3  (17 unrouted)
  Top 0.457: REG_3V3.TAB 22.86,43.5
  Top 0.813: REG_3V3.2 22.86,43.5 27.62,40.01 27.62,34.61 D_PSU2.A | 29.21,60.96 27.3,59.69 27.3,51.44 22.86,47.62 REG_3V3.TAB | 38.1,104.14 48.9,86.36 38.1,63.5 | R_TEMP.2 54.61,104.14
  Bottom 0.457: 76.36,84.93 76.2,86.36
  Bottom 0.813: D_PSU2.A CP31.+ 38.1,34.29 D_3V3.A | U$6.+3.3V C_RTC.2 76.36,84.93 76.2,85.72 79.38,103.5 | 76.2,86.36 69.22,86.36 | R_TEMP.2 TEMP_SENSOR.3 66.04,106.68 67.94,105.41 71.75,101.6 | 48.9,86.36 C_BT.1
+5V  (via drill 0.61)  (16 unrouted)
  Top 0.457: D_PSU1.A 24.13,22.86 REG_5V.2 REG_5V.TAB 24.13,12.06 CP51.+ | 114.94,6.35 RO43.2 | 100.33,6.35 96.52,6.35 | 76.52,48.26 R_URES.1
  Top 0.813: 36.2,15.24 36.2,13.34 35.56,12.06 CP51.+ | 36.2,15.24 D_5V.A | 36.2,15.24 36.2,47.62 38.73,50.8 38.73,52.7 J_5V.1 | R_URES.1 77.47,49.53 D_URES.C | C_U.2 IO_UC.7 64.77,27.3 IO_UC.21 | AUTO.1 60.96,11.43 60.96,17.78 IN_BUTTONS.9 IO_UC.20 | RO53.2 RO63.2 RO73.2 RO83.2 RO13.2 114.94,43.81 | 114.94,43.81 RO23.2 RO33.2 114.94,6.35 100.33,6.35 100.33,22.86 FTDI.3 92.71,26.67 92.71,41.27 91.44,42.55 81.92,42.55 80.64,43.81 80.64,48.26 76.52,48.26 | 114.94,43.81 123.19,45.09 v182.25,48.9
  Bottom 0.813: IO_UC.21 IO_UC.20 | R_URES.1 73.03,48.26 72.39,45.72 72.39,40.32 68.9,36.83 C_U.2 | D_5V.A 45.72,17.78 52.39,17.78 58.42,10.48 AUTO.1
AUTO_MANUAL  (via drill 0.61)  (2 unrouted)
  Top 0.457: IO_UC.17 55.88,22.86 AUTO.2 | v58.42,88.27 v40.64,75.56
  Bottom 0.457: R_AUTO.2 62.23,6.67 56.83,6.67 AUTO.2 | v40.64,75.56 15.24,75.56 | v58.42,88.27 40.64,58.42 44.45,55.24 44.45,27.94 45.72,26.67 52.07,26.67 IO_UC.17
BT_RX  (2 unrouted)
BT_TX  (2 unrouted)
CP12
  Top 0.457: 24.77,38.42 25.08,38.73 REG_3V3.3 | D_PSU1.C 19.05,19.68 REG_5V.3
  Top 0.813: 24.77,38.42 24.77,37.47 22.23,34.29 D_PSU2.C D_PSU1.C
  Bottom 0.457: D_PSU1.C 17.78,25.4
  Bottom 0.813: D_PSU.C 13.97,20.95 16.51,25.4 D_PSU1.C | 17.78,25.4 CP01.+
EN_ESP32  (1 unrouted)
GND  (63 unrouted)
  Top 0.813: REG_5V.1 33.02,18.34 CP51.- | CP01.- 14.29,31.75 14.29,38.73 20.55,38.73 REG_3V3.1
  pour Bottom (isolate 0.305): -99.06,45.09 -44.45,53.98 -25.4,-26.67 -99.06,-70.48
IN1
  Bottom 0.457: IO_UC.18 57.15,17.78 58.42,15.24 64.77,15.24 | RI1.1 64.77,15.24 | 64.77,15.24 IN_BUTTONS.8
IN2
  Top 0.457: IN_BUTTONS.7 RI2.1
  Bottom 0.457: IO_UC.19 61.28,21.91 65.09,21.91 IN_BUTTONS.7
IN3
  Top 0.457: RI3.1 IN_BUTTONS.6 IO_UC.23
IN4
  Top 0.457: RI4.1 IN_BUTTONS.5 IO_UC.24
IN5
  Top 0.457: RI5.1 IN_BUTTONS.4 IO_UC.25
IN6
  Top 0.457: RI6.1 IN_BUTTONS.3 IO_UC.26
IN7
  Top 0.457: IO_UC.27 IN_BUTTONS.2 RI7.1 80.01,5.08 91.44,5.08 92.71,2.54 97.16,2.54
IN8
  Top 0.457: RI8.1 IN_BUTTONS.1 IO_UC.28
  Bottom 0.457: 96.52,8.89 82.55,8.89 RI8.1
L1-1  (4 unrouted)
  Bottom 0.457: 151.45,51.75 151.29,52.23 151.76,52.39 151.13,40.32
  Bottom 2.184: 151.45,51.75 157.48,51.75 SKT1.5
L1-2  (4 unrouted)
  Bottom 0.457: 162.56,104.14 SKT2.5
  Bottom 2.184: 157.48,109.22 162.56,104.14
L_AUTOMANUAL  (3 unrouted)
L_O1  (2 unrouted)
  Bottom 0.457: 120.02,39.37 LO2.K 128.91,39.37
L_O3  (2 unrouted)
  Bottom 0.457: 121.28,25.4 LO3.K 128.91,25.4
L_URX  (3 unrouted)
L_UTX  (3 unrouted)
LED2  (1 unrouted)
MISO  (2 unrouted)
MO1
  Bottom 0.457: 161.29,35.56 SKT1.4
  Bottom 2.184: FUSE1.2 155.89,43.18 157.8,40.32 161.29,35.56
MO2
  Bottom 2.184: FUSE2.2 158.12,31.43 SKT1.3
MO3
  Bottom 2.184: FUSE3.2 157.48,24.77 SKT1.2
MO4
  Bottom 2.184: FUSE4.2 159.7,13.02 SKT1.1
MO5
  Bottom 0.457: 162.56,99.06 SKT2.4
  Bottom 2.184: FUSE5.2 162.24,99.06 162.56,99.06
MO6
  Bottom 2.184: FUSE6.2 157.16,94.3 SKT2.3
MO7
  Bottom 2.184: FUSE7.2 156.84,77.47 159.07,88.58 162.56,88.9 SKT2.2
MO8
  Bottom 2.184: FUSE8.2 162.56,76.2 SKT2.1
MOSI  (2 unrouted)
N$2  (1 unrouted)
N$3  (1 unrouted)
  Bottom 2.184: 142.24,49.85 FUSE1.1
N$4
  Bottom 0.457: PR_5V.2 41.91,19.05 D_5V.K
N$5
  Bottom 0.813: PR_3.3V.2 40.64,40.64 D_3V3.K
N$6  (1 unrouted)
N$7
  Bottom 0.457: 5.08,25.4 PSU.1
  Bottom 0.813: 5.08,25.4 D_PSU.A
N$8  (1 unrouted)
N$9  (1 unrouted)
N$10  (1 unrouted)
N$11
  Bottom 0.457: LO5.A RO53.1
N$12  (2 unrouted)
  Bottom 0.457: 120.02,110.49 LO5.K 128.91,110.49
N$13  (1 unrouted)
  Bottom 2.184: 140.97,77.79 FUSE7.1
N$14  (1 unrouted)
  Bottom 2.184: 142.24,35.24 FUSE2.1
N$15  (1 unrouted)
N$16
  Bottom 0.457: LO6.A RO63.1
N$18  (1 unrouted)
N$19  (1 unrouted)
  Bottom 2.184: 141.6,92.39 FUSE6.1
N$20
  Bottom 0.457: LO7.A RO73.1
N$21  (2 unrouted)
  Bottom 0.457: 120.02,82.55 LO7.K 128.91,82.55
N$22  (1 unrouted)
N$23  (1 unrouted)
N$24  (1 unrouted)
N$25
  Bottom 0.457: LO8.A RO83.1
N$26  (2 unrouted)
  Bottom 0.457: 120.02,68.58 LO8.K 128.91,68.58
N$27  (1 unrouted)
N$28  (1 unrouted)
N$29
  Bottom 0.457: LO1.A RO13.1
N$30  (2 unrouted)
  Bottom 0.457: 120.02,53.34 LO1.K 128.91,53.34
N$31  (1 unrouted)
N$32
  Top 0.457: C_UXTAL1.1 XTALU.2 60.96,46.99 60.96,36.83 IO_UC.9
N$33
  Bottom 0.457: LO2.A RO23.1
N$35
  Top 0.457: C_UXTAL2.1 55.88,48.26 XTALU.1 55.88,47.62 55.88,36.83 IO_UC.10
N$37
  Bottom 0.457: LO3.A RO33.1
N$38  (1 unrouted)
N$41
  Bottom 0.457: LO4.A RO43.1
N$42  (2 unrouted)
  Bottom 0.457: 121.28,11.43 LO4.K 128.91,11.43
N$43  (2 unrouted)
N$44  (2 unrouted)
N$47  (1 unrouted)
OUT1  (via drill 0.61)
  Top 0.457: v78.11,-5.71 IO_UC.4
  Bottom 0.457: v78.11,-5.71 100.97,38.73 100.97,49.53 RO11.2 RO12.2
OUT2  (via drill 0.61)
  Top 0.457: v74.93,-5.71 IO_UC.5
  Bottom 0.457: v74.93,-5.71 100.97,37.47 RO22.2 RO21.2
OUT3  (via drill 0.61)
  Top 0.457: IO_UC.6 71.75,29.84 v76.2,-9.53
  Bottom 0.457: RO32.2 RO31.2 100.97,29.21 100.97,33.66 99.69,34.92 92.08,34.92 90.81,33.66 90.81,30.48 89.53,29.84 v76.2,-9.53
OUT4
  Bottom 0.457: RO41.2 RO42.2 104.78,8.89 105.73,10.79 105.73,27.94 104.78,29.21 103.5,29.21 102.23,30.48 102.23,34.92 100.97,36.2 90.81,36.2 88.9,34.29 59.05,34.29 IO_UC.11
OUT5
  Bottom 0.457: IO_UC.12 54.61,38.73 55.88,40.01 68.58,40.01 70.48,41.91 70.48,61.59 71.75,63.5 87,63.5 88.27,62.23 88.27,59.69 89.53,58.42 109.22,58.42 110.49,59.69 110.49,106.68 109.22,107.95 R51.2 RO52.2
OUT6
  Bottom 0.457: IO_UC.13 52.07,39.37 53.98,41.91 67.31,41.91 68.58,43.18 68.58,63.5 70.48,65.41 88.9,65.41 90.17,64.14 90.17,61.59 91.44,60.33 107.31,60.33 108.58,61.59 108.58,93.98 107.31,95.25 R61.2 RO62.2
OUT7
  Bottom 0.457: IO_UC.14 49.53,39.37 52.07,43.81 65.41,43.81 66.67,45.09 66.67,64.77 69.22,67.31 90.81,67.31 92.08,66.04 92.08,63.5 93.34,62.23 105.41,62.23 106.68,63.5 106.68,78.11 RO71.2 RO72.2
OUT8
  Top 0.457: IO_UC.15 46.99,24.13 45.72,25.4 45.72,33.97 46.35,34.92 49.53,34.92 50.16,35.56 50.16,66.36 52.07,68.58 59.69,68.58 60.96,69.85 RO82.2
  Bottom 0.457: RO82.2 RO81.2
PRESS_SEN1  (3 unrouted)
PRESS_SEN2  (3 unrouted)
RTS  (via drill 0.61)
  Top 0.457: FTDI.6 v71.75,-5.71
  Bottom 0.457: v71.75,-5.71 C_URTS.1
SCK  (2 unrouted)
SCL  (via drill 0.61)  (5 unrouted)
  Top 0.457: 57.15,73.66 v62.87,88.27
  Bottom 0.457: U$6.SCL 67.94,78.74 OLED_DISPLAY.1 57.15,73.66
SD_CS  (2 unrouted)
SDA  (4 unrouted)
  Bottom 0.457: U$6.SDA 67.94,81.28 OLED_DISPLAY.2 60.33,81.28 52.39,71.44 18.1,71.44
SPARE_IO0  (1 unrouted)
SPARE_IO1  (1 unrouted)
SPARE_IO2  (1 unrouted)
SPARE_IO3  (1 unrouted)
SPARE_IO6  (1 unrouted)
SPARE_IO7  (1 unrouted)
SPARE_IO8  (1 unrouted)
SPARE_IO9  (1 unrouted)
SPARE_IO10  (1 unrouted)
SPARE_IO11  (1 unrouted)
SPARE_IO12  (1 unrouted)
SPARE_IO13  (1 unrouted)
SPARE_IO14  (1 unrouted)
SPARE_IO15  (1 unrouted)
SPARE_IO34  (1 unrouted)
SPARE_IO35  (1 unrouted)
STAY_ALIVE1  (2 unrouted)
STAY_ALIVE2  (2 unrouted)
TEMP_SEN  (2 unrouted)
  Top 0.457: TEMP_SENSOR.2 R_TEMP.1
  Bottom 0.457: 13.97,71.12 11.43,71.75 11.43,75.56 14.61,77.47 53.02,77.47 54.61,79.06 R_TEMP.1
U_RESET  (via drill 0.61)
  Top 0.457: v68.58,-5.71 82.55,34.92 | 82.55,34.92 IO_UC.1 | 97.79,13.34 96.52,14.61 89.22,14.61 87.63,15.88 87.63,34.92 86.36,35.56 83.82,35.56 82.55,34.92
  Bottom 0.457: U_RESET.3 80.01,55.88 82.55,55.88 U_RESET.4 85.41,55.88 85.41,52.39 D_URES.A 85.09,50.16 82.55,49.21 82.55,48.26 | 82.55,48.26 v68.58,-5.71 C_URTS.2 | 82.55,48.26 R_URES.2
U_RX  (2 unrouted)
  Bottom 0.457: 78.74,27.94 78.74,29.84 80.01,30.48 IO_UC.2 | FTDI.4 78.74,27.94 | 44.45,66.04 45.09,64.77 45.09,59.69 46.99,58.42 46.99,29.84 48.26,27.94 78.74,27.94
U_TX  (2 unrouted)
  Top 0.457: IO_UC.3 77.47,41.59 76.2,42.86 RDX.2
UTX
  Top 0.457: RDX.1 97.67,45.72 99.06,44.45 99.06,30.48 FTDI.5
(copper drawn outside any net)
  shapes: Bottom area x1752

### Text on the board
Bottom: DANGER / LIVE MAINS
tNames: 3V3 | Temp_Sig | GND | GND | 3V3 | SDA | SCL | DANGER | LIVE MAINS | SCL | SDA | SD_CS | U_TX | SCK | U_RX | MOSI | NEW_IN | L1-2 | MISO | BT_TX | FLASH_DO | BT_RX | OUT5 | FLASH_DI | GND | FLASH_CLK | OUT6 | FLASH_CS | OUT7 | OUT8 | Aut/Man | Temp_Sig | LINK | 3V3 | LINK | DANGER / LIVE MAINS | 5V | L1-1 | OUT1 | OUT2 | ATMEGA328-20P | OUT3 | 5V | In1 | In2 | In3 | In4 | In5 | In6 | In7 | In8 | Freerangelobster.blogspot.co.uk / https://github.com/FreeRangeLobster/FishHank / Version 3.0 / 10/02/2020 | OUT4 | VIn | RTS | UTX | GND | URX | AUTO/MANUAL | 5V | +5 | GND | GND | GND | MOSI | RESET | SCK | 5V | MISO